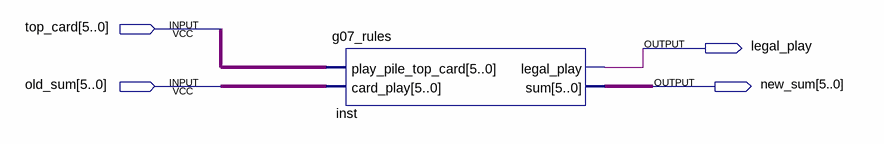
[diagram p0: schematic sheet]
// Quartus schematic g07_testing.bdf as structural Verilog: 1 symbols, 4 pins
module g07_testing (
  input  [5:0] top_card,
  input  [5:0] old_sum,
  output legal_play,
  output [5:0] new_sum
);

  g07_rules inst (.play_pile_top_card(top_card), .card_play(old_sum), .legal_play(legal_play), .sum(new_sum));
endmodule
